# Altium project Sixth_Sense_PCB_Final.PrjPcb
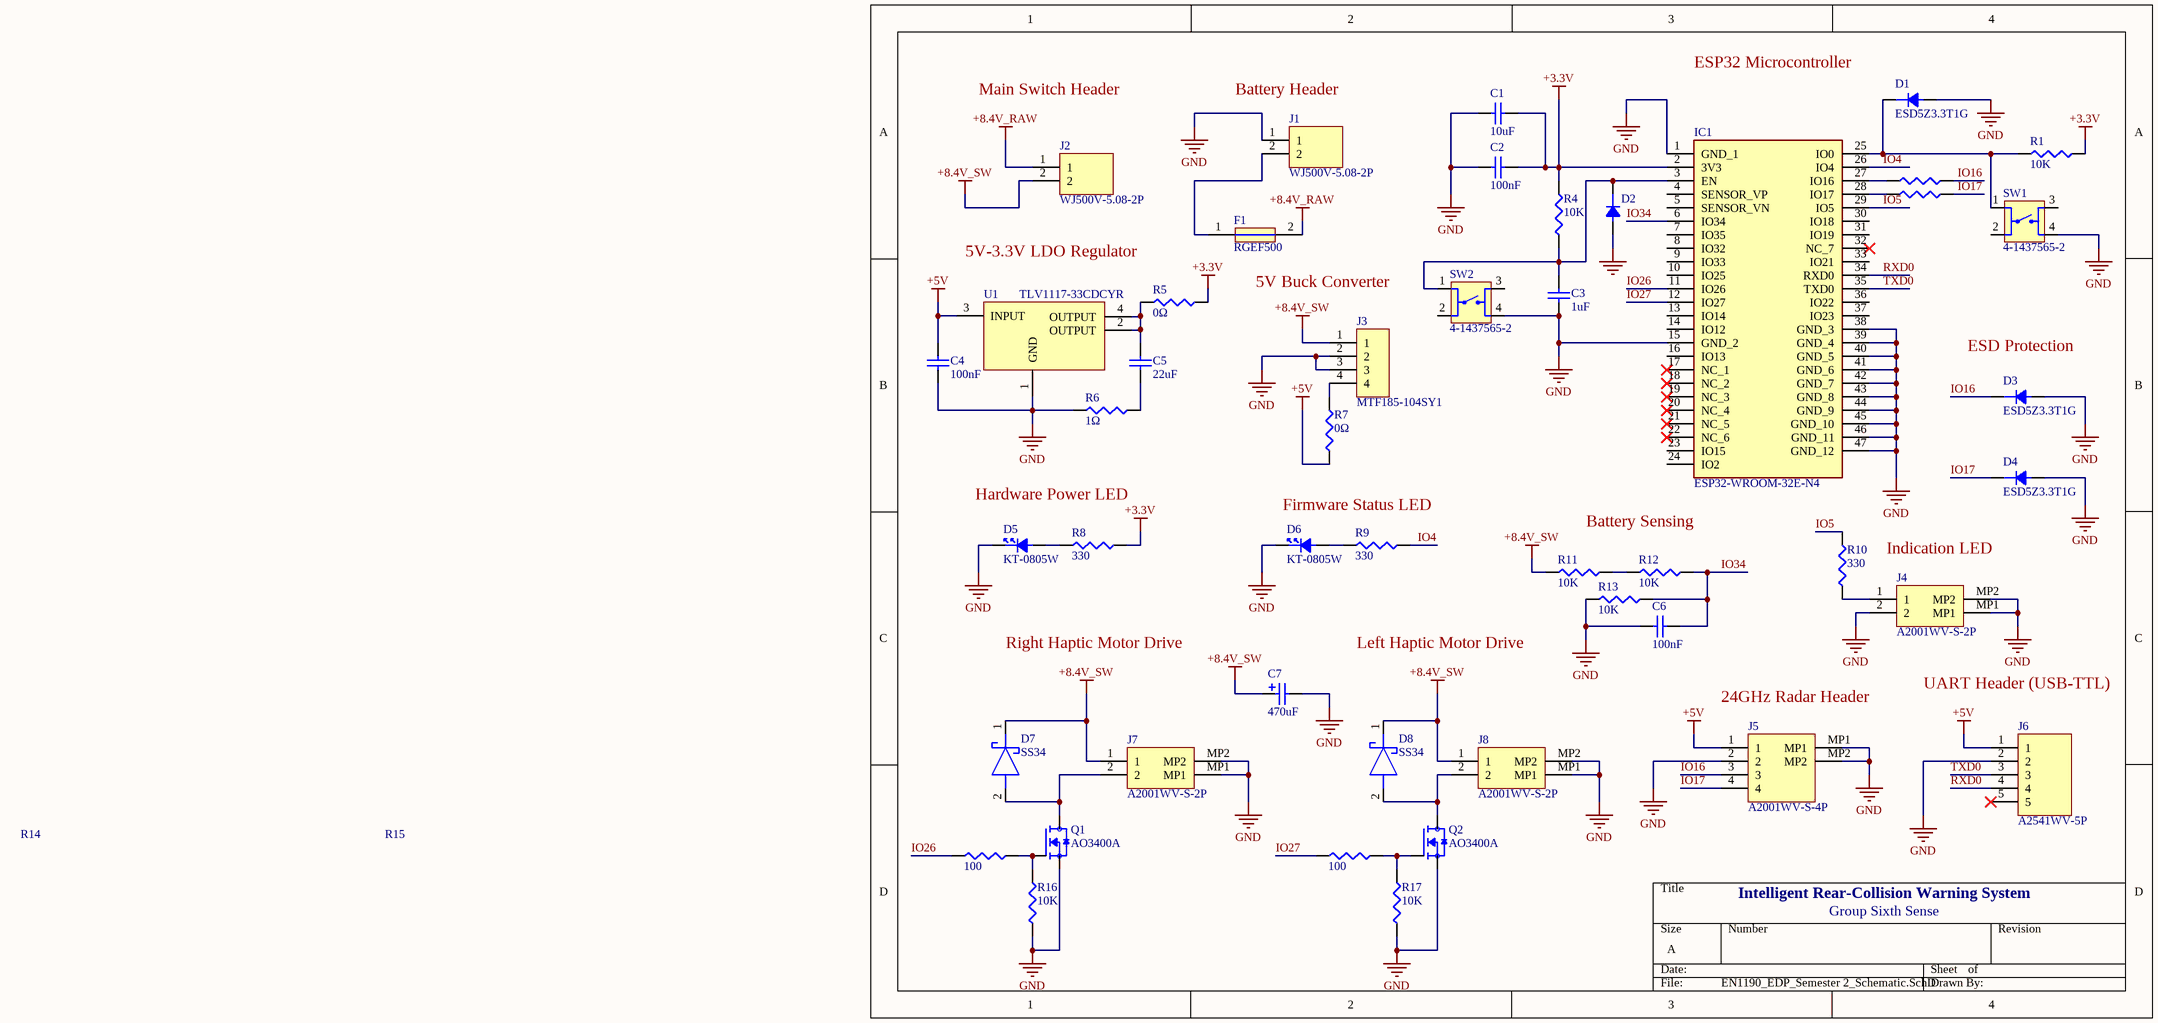
[diagram p0: EN1190_EDP_Semester 2_Schematic.SchDoc]
1 sheet, 47 parts. Net scope: global (net labels, ports and power ports of the same name join across sheets).
Board file: EN1190_EDP_Semester 2_PCB.PcbDoc

## Sheet EN1190_EDP_Semester 2_Schematic.SchDoc
size A; SheetNumber: 1; SheetTotal: 1

### Parts
C1  10uF  [CAPC2012X145N]
C2  100nF  [CAPC2012X70]
C3  1uF  [CAPC2012X135N]
C4  100nF  [CAPC2012X70]
C5  22uF  [CAPC3216X180N]
C6  100nF  [CAPC2012X70]
C7  470uF  [CAPPRD500W60D1025H1400]
D1  ESD5Z3.3T1G  [SODFL1608X70N]
D2  ESD5Z3.3T1G  [SODFL1608X70N]  (value not drawn)
D3  ESD5Z3.3T1G  [SODFL1608X70N]
D4  ESD5Z3.3T1G  [SODFL1608X70N]
D5  KT-0805W  [LED_KT-0805W]
D6  KT-0805W  [LED_KT-0805W]
D7  SS34  [DIOM5127X241N]
D8  SS34  [DIOM5127X241N]
F1  RGEF500  [RGEF500]
IC1  ESP32-WROOM-32E-N4  [ESP32WROOM32EN4]
J1  WJ500V-5.08-2P  [WJ500V5082P]
J2  WJ500V-5.08-2P  [WJ500V5082P]
J3  MTF185-104SY1  [RHDR4W64P0X254_1X4_1041X250X865P]
J4  A2001WV-S-2P  [A2001WVS2P]
J5  A2001WV-S-4P  [A2001WVS4P]
J6  A2541WV-5P  [HDRV5W64P0X254_1X5_1270X254X899P]
J7  A2001WV-S-2P  [A2001WVS2P]
J8  A2001WV-S-2P  [A2001WVS2P]
Q1  AO3400A  [SOT95P280X125-3N]
Q2  AO3400A  [SOT95P280X125-3N]
R1  10K  [RESC2012X65N]
R2  0Ω  [RESC2012X65N]  (value not drawn)
R3  0Ω  [RESC2012X65N]  (value not drawn)
R4  10K  [RESC2012X65N]
R5  0Ω  [RESC2012X65N]
R6  1Ω  [RESC2012X65N]
R7  0Ω  [RESC2012X65N]
R8  330  [RESC2012X65N]
R9  330  [RESC2012X65N]
R10  330  [RESC2012X65N]
R11  10K  [RESC2012X65N]
R12  10K  [RESC2012X65N]
R13  10K  [RESC2012X65N]
R14  100  [RESC2012X65N - duplicate]
R15  100  [RESC2012X65N - duplicate]
R16  10K  [RESC2012X65N]
R17  10K  [RESC2012X65N]
SW1  4-1437565-2  [SW_4-1437565-2]
SW2  4-1437565-2  [SW_4-1437565-2]
U1  TLV1117-33CDCYR  [SOT230P700X180-4N]

### Nets
+3.3V: C1.2 C2.1 IC1.2(3V3) R1.2 R4.1 R5.2 R8.2
+5V: C4.2 J5.1 J6.1 R7.1 U1.3(INPUT)
+8.4V_RAW: F1.2 J2.1
+8.4V_SW: C7.1 D7.1(K) D8.1(K) J2.2 J3.1 J7.1 J8.1 R11.2
GND: C1.1 C2.2 C3.1 C4.1 C6.1 C7.2 D1.2 D2.2 D3.2 D4.2 D5.1 D6.1 IC1.1(GND_1) IC1.15(GND_2) IC1.38(GND_3) IC1.39(GND_4) IC1.40(GND_5) IC1.41(GND_6) IC1.42(GND_7) IC1.43(GND_8) IC1.44(GND_9) IC1.45(GND_10) IC1.46(GND_11) IC1.47(GND_12) J1.1 J3.2 J3.3 J4.2 J4.MP1 J4.MP2 J5.2 J5.MP1 J5.MP2 J6.2 J7.MP1 J7.MP2 J8.MP1 J8.MP2 Q1.2(S) Q2.2(S) R6.2 R13.1 R16.2 R17.2 SW1.4 SW2.4 U1.1(GND)
IO4: IC1.26(IO4) R9.2
IO5: IC1.29(IO5) R10.2
IO16: D3.1 J5.3 R2.2
IO17: D4.1 J5.4 R3.2
IO26: IC1.11(IO26) R14.1
IO27: IC1.12(IO27) R15.1
IO34: C6.2 IC1.6(IO34) R12.1 R13.2
RXD0: IC1.34(RXD0) J6.4
TXD0: IC1.35(TXD0) J6.3
NetC3_2: C3.2 D2.1 IC1.3(EN) R4.2 SW2.1
NetC5_1: C5.1 R6.1
NetC5_2: C5.2 R5.1 U1.2(OUTPUT) U1.4(OUTPUT)
NetD1_1: D1.1 IC1.25(IO0) R1.1 SW1.1
NetD5_2: D5.2 R8.1
NetD6_2: D6.2 R9.1
NetD7_2: D7.2(A) J7.2 Q1.3(D)
NetD8_2: D8.2(A) J8.2 Q2.3(D)
NetF1_1: F1.1 J1.2
NetIC1_27: IC1.27(IO16) R2.1
NetIC1_28: IC1.28(IO17) R3.1
NetJ3_4: J3.4 R7.2
NetJ4_1: J4.1 R10.1
NetQ1_1: Q1.1(G) R14.2 R16.1
NetQ2_1: Q2.1(G) R15.2 R17.1
NetR11_1: R11.1 R12.2

Not connected (* = marked no-connect by the designer): IC1 4(SENSOR_VP) 5(SENSOR_VN) 7(IO35) 8(IO32) 9(IO33) 10(IO25) 13(IO14) 14(IO12) 16(IO13) 17(NC_1)* 18(NC_2)* 19(NC_3)* 20(NC_4)* 21(NC_5)* 22(NC_6)* 23(IO15) 24(IO2) 30(IO18) 31(IO19) 32(NC_7)* 33(IO21) 36(IO22) 37(IO23); J6 5*; SW1 2 3; SW2 2 3

### Notes on the sheet
- Main Switch Header
- (near J1) Battery Header
- (near D1) ESP32 Microcontroller
- 5V-3.3V LDO Regulator
- 5V Buck Converter
- (near D3) ESD Protection
- Hardware Power LED
- Firmware Status LED
- Battery Sensing
- Indication LED
- Right Haptic Motor Drive
- Left Haptic Motor Drive
- (near J5) 24GHz Radar Header
- UART Header (USB-TTL)
- Intelligent Rear-Collision Warning System
- Group Sixth Sense

### Library data of the parts
C1 = CL21A106KAYNNNE: 10uF ±10% 25V Ceramic Capacitor X5R 0805; Manufacturer: Samsung Electro-Mechanics; Value: 10uF; LCSC Part Number: C15850; JLCPCB Part Number: C15850; ComponentLink1Description: Datasheet; ComponentLink1URL: https://jlc-prod-smt.oss-eu-central-1.aliyuncs.com/smtDataManualFile/8579706853607202816-C15850.pdf?response-content-disposition=attachment%3B%20filename%3DC15850.pdf%3B%20filename%2A%3DUTF-8%27%27C15850.pdf&x-oss-date=20260411T105511Z&x-oss-expires=1800&x-oss-security-token=CAISgAN1q6Ft5B2yfSjIr5mHBczCp%2BpM0aimbG72lWcPTrsdp4f41zz2IHhMdHJsAOodtv0%2FmmhT6PkclqRLcbhpcmfjV%2BZHzLB8qakU4QF%2B4J7b16cNrbH4M4H6aXeirtuwDsz9SNTCALjPD3nPii50x5bjaDymRCbLGJaViJlhHLN1Ow6jdmhpCctxLAlvo9NgFxm3D%2Fu2NQPwiWf9FVdhvhEG6Vly8qOi2MaRmFy8yFTx0b0SvJ%2BjYMrmPctoN9JnSdC5mfdzau3a1TJ84gRD0a5wkaVA1zbDs5bfISEIuUzebreLqY03dV4mOvdqIcMe8qigz88fk%2FfIioH6xyxKOexoSCnFTOiiupCcQLPyao9jLu6iayqViY7QaIOTqQohZmkAMwVOasAsI3Ngh4zF97Qt0cVNkXO9gWfLI8DtuMleWsqp384DfnSgc5lCkRRYwGs1287ugXlSQzo890KPDAEovaKCnZ2ZSfh7Y4sNknI6i%2Bfc2Se2MIkISql4QaKWD5sagAEl%2FZh4y0mMFih4O2qONNFgo7OWr5xiyzqit1WFcmyLUIQ2NX%2Fko74FscrX5Z2PR81zrkE2%2BnLnFVK6SDKZ8Rrb9W3QelFNDx6QYlqH4AjNB9BxVOfYIzA8I8Ll0VvOEyDZ7hj5WXI%2BIfDeUmHR%2FNs6j%2FCz6XaWmqPEfMDbSSnTGiAA&x-oss-signature-version=OSS4-HMAC-SHA256&x-oss-credential=STS.NZ2NvvJ5mfjMnHGqgZB41HBS5%2F20260411%2Feu-central-1%2Foss%2Faliyun_v4_request&x-oss-signature=e4669f9a7ebed36f2888fbdcc03d20f0a9c6abf700cb8098047f1d5397c325ce; Manufacturer Part Number: CL21A106KAYNNNE
C2 C4 C6 = CC0805KRX7R9BB104: 100nF ±10% 50V Ceramic Capacitor X7R 0805; Manufacturer: YAGEO; Value: 100nF; Manufacturer Part Number: CC0805KRX7R9BB104; LCSC Part Number: C49678; JLCPCB Part Number: C49678; ComponentLink1Description: Datasheet; ComponentLink1URL: https://jlc-prod-smt.oss-eu-central-1.aliyuncs.com/smtDataManualFile/8579706882459549696-C49678.pdf?response-content-disposition=attachment%3B%20filename%3DC49678.pdf%3B%20filename%2A%3DUTF-8%27%27C49678.pdf&x-oss-date=20260411T120022Z&x-oss-expires=1800&x-oss-security-token=CAISgAN1q6Ft5B2yfSjIr5nGc%2B%2Fng%2BZTz6qoZ1LerE00VusYva%2FoiTz2IHhMdHJsAOodtv0%2FmmhT6PkclqRLcbhpcmfjV%2BZHzLB8qZxIqQR%2B4J7b16cNrbH4M4H6aXeirtuwDsz9SNTCALjPD3nPii50x5bjaDymRCbLGJaViJlhHLN1Ow6jdmhpCctxLAlvo9NgFxm3D%2Fu2NQPwiWf9FVdhvhEG6Vly8qOi2MaRmFy8yFTx0b0SvJ%2BjYMrmPctoN9JnSdC5mfdzau3a1TJ84gRD0a5wkaVA1zbDs5bfISEIuUzebreLqY03dV4mOvdqIcMe8qigz88fk%2FfIioH6xyxKOexoSCnFTOiiupCcQLPyao9jLu6iayqViY7QaIOTqQohZmkAMwVOasAsI3Ngh4zF97Qt0cVNkXO9gWfLI8DtuMleWgpjW%2BgjfnSgc5lCkRRYwGs1287ugXlSQzo890KPDAEovaKCnZ2ZSfh7Y4sNknI6i%2Bfc2Se2MIkIet4joqKWD5sagAGoaAFtiNH%2BVqesP4Xd%2FicMChU4hC%2BfFSKA8gk%2FP%2BHFmqX9GC9FZogyDW2xwxXMN%2BJ5kWUM5GYkddsvBUaVRQY2O5hriYbqbheGKrzCEsRoZQpM1BVK9kdwDFJRIKfktOAz8byi%2FH7to7wLWy8UkpOhwQ%2B%2BZ%2FjjINlLWCMSxpgZsCAA&x-oss-signature-version=OSS4-HMAC-SHA256&x-oss-credential=STS.NZs8USn9rxhCetoHMaZd4RjCk%2F20260411%2Feu-central-1%2Foss%2Faliyun_v4_request&x-oss-signature=707c7aad44b40ae88f8940f66cbb3d06b4fd0582da1b3e21eb645b0540d9b004
C3 = CL21B105KBFNNNE: 1uF ±10% 50V Ceramic Capacitor X7R 0805; Manufacturer: Samsung Electro-Mechanics; LCSC Part Number: C28323; Value: 1uF; Manufactuer Part Number: CL21B105KBFNNNE; JLCPCB Part Number: C28323; ComponentLink1Description: Datasheet; ComponentLink1URL: https://jlcpcb.com/api/file/downloadByFileSystemAccessId/8579706862004473856
C5 = CL31A226KOHNNNE: 22uF ±10% 16V Ceramic Capacitor X5R 1206; LCSC Part Number: C90146; Value: 22uF; Voltage Rating: 16V; Dielectric: X5R; Package: 1206; ComponentLink1Description: Datasheet; ComponentLink1URL: https://www.lcsc.com/datasheet/C90146.pdf?spm=wm.sxq.inf.ggs___wm.ssy.bg.0.xh&lcsc_vid=RABaBF1SE1RfBlVeElBYVQJWQVdaBVJRQ1JYAwFXQFYxVlNRQlFcXlNeTlVbUjsOAxUeFF5JWBYZEEoKFBINSQcJGk4dAgUUFAk%3D
C7 = 25YXJ470M10X12.5: 470uF 25V Aluminum Electrolytic Capacitors Through Hole,D10xL12.5mm 10000hrs@105℃; Manufacturer: Rubycon; Value: 470 uF; LCSC Part Number: C88740; JLCPCB Part Number: C88740; Manufacturer Part Number: 25YXJ470M10X12.5; ComponentLink1Description: Datasheet; ComponentLink1URL: https://jlc-prod-smt.oss-eu-central-1.aliyuncs.com/smtDataManualFile/8588887453180563456-C88740.pdf?response-content-disposition=attachment%3B%20filename%3DC88740.pdf%3B%20filename%2A%3DUTF-8%27%27C88740.pdf&x-oss-date=20260411T113131Z&x-oss-expires=1800&x-oss-security-token=CAISgAN1q6Ft5B2yfSjIr5mHBczCp%2BpM0aimbG72lWcPTrsdp4f41zz2IHhMdHJsAOodtv0%2FmmhT6PkclqRLcbhpcmfjV%2BZHzLB8qakU4QF%2B4J7b16cNrbH4M4H6aXeirtuwDsz9SNTCALjPD3nPii50x5bjaDymRCbLGJaViJlhHLN1Ow6jdmhpCctxLAlvo9NgFxm3D%2Fu2NQPwiWf9FVdhvhEG6Vly8qOi2MaRmFy8yFTx0b0SvJ%2BjYMrmPctoN9JnSdC5mfdzau3a1TJ84gRD0a5wkaVA1zbDs5bfISEIuUzebreLqY03dV4mOvdqIcMe8qigz88fk%2FfIioH6xyxKOexoSCnFTOiiupCcQLPyao9jLu6iayqViY7QaIOTqQohZmkAMwVOasAsI3Ngh4zF97Qt0cVNkXO9gWfLI8DtuMleWsqp384DfnSgc5lCkRRYwGs1287ugXlSQzo890KPDAEovaKCnZ2ZSfh7Y4sNknI6i%2Bfc2Se2MIkISql4QaKWD5sagAEl%2FZh4y0mMFih4O2qONNFgo7OWr5xiyzqit1WFcmyLUIQ2NX%2Fko74FscrX5Z2PR81zrkE2%2BnLnFVK6SDKZ8Rrb9W3QelFNDx6QYlqH4AjNB9BxVOfYIzA8I8Ll0VvOEyDZ7hj5WXI%2BIfDeUmHR%2FNs6j%2FCz6XaWmqPEfMDbSSnTGiAA&x-oss-signature-version=OSS4-HMAC-SHA256&x-oss-credential=STS.NZ2NvvJ5mfjMnHGqgZB41HBS5%2F20260411%2Feu-central-1%2Foss%2Faliyun_v4_request&x-oss-signature=1a71cdcfdccf2f12d85f81b9bbe3019779a73c3eac2156f4ea9bb6aa6537d4d7
D1-D4 = ESD5Z3.3T1G: 14.1VC Clamp 11.2A Ipp TVS DIODE SOD-523; Manufacturer: onsemi; Package: SOD-523; Manufactuer Part Number: ESD5Z3.3T1G; LCSC Part Number: C61148; JLCPCB Part Number: C61148
D5 D6 = KT-0805W: White LED Indication - Discrete 2.6V~3.2V 0805; Manufacturer: Hubei KENTO Elec; Package: 0805; Manufacturer Part Number: KT-0805W; LCSC Part Number: C34499; JLCPCB Part Number: C34499; ComponentLink1Description: Datasheet; ComponentLink1URL: https://jlc-prod-smt.oss-eu-central-1.aliyuncs.com/smtDataManualFile/8579709217554550784-C34499.pdf?response-content-disposition=attachment%3B%20filename%3DC34499.pdf%3B%20filename%2A%3DUTF-8%27%27C34499.pdf&x-oss-date=20260411T184242Z&x-oss-expires=1800&x-oss-security-token=CAISgAN1q6Ft5B2yfSjIr5rxL87d1ahJ54SaRGiFlmVtZtlOi%2FzfgDz2IHhMdHJsAOodtv0%2FmmhT6PkclqRLcbhpcmfjV%2BZHzLB8qedY9A1%2B4J7b16cNrbH4M4H6aXeirtuwDsz9SNTCALjPD3nPii50x5bjaDymRCbLGJaViJlhHLN1Ow6jdmhpCctxLAlvo9NgFxm3D%2Fu2NQPwiWf9FVdhvhEG6Vly8qOi2MaRmFy8yFTx0b0SvJ%2BjYMrmPctoN9JnSdC5mfdzau3a1TJ84gRD0a5wkaVA1zbDs5bfISEIuUzebreLqY03dV4mOvdqIcMe8qigz88fk%2FfIioH6xyxKOexoSCnFTOiiupCcQLPyao9jLu6iayqViY7QaIOTqQohZmkAMwVOasAsI3Ngh4zF97Qt0cVNkXO9gWfLI8DtuMleWhqk2cFN4NHD0eS19jklBdzSlusJRAJJUVBflCeKEaRNSAd3WGhEfM2%2BBt4QT30w5N2u00S8OSMI6E2D5aKWD5sagAFK8BQxMu8mWm493Yp8afuko%2BzCNYQ%2Fa05kesz6Q%2FupjBJH0QROBTrIeTMPgE8%2BlaT39xZqteU6mYIp0xOFqOLJoWNfG8KcrwmMtaWL3ntf0XKyARj9oJ%2FZoCX14gg3wra056deeiiUhn7e1b6JV2uHe3%2BhOvW6pNMsqkWNyqxHxSAA&x-oss-signature-version=OSS4-HMAC-SHA256&x-oss-credential=STS.NYDdti8whPFqFN4re8jVbd9tb%2F20260411%2Feu-central-1%2Foss%2Faliyun_v4_request&x-oss-signature=fb576c8a806889d858e314a909d44b6f08958b502a4255edb32084c04d6872af
D7 D8 = SS34 SMA: Diode Independent 40V 3A Surface Mount SMA(DO-214AC); Manufacturer: MDD(Microdiode Semiconductor); LCSC Part Number: C8678; Manufacturer Part Number: SS34; ComponentLink1Description: Datasheet; ComponentLink1URL: https://www.lcsc.com/datasheet/C8678.pdf?spm=wm.sxq.inf.ggs___wm.ssy.bg.2.xh&lcsc_vid=RABaBF1SE1RfBlVeElBYVQJWQVdaBVJRQ1JYAwFXQFYxVlNRQlBfVVNfT1hcXzsOAxUeFF5JWBYZEEoKFBINSQcJGk4dAgUUFAk%3D; JLCPCB Part Number: C8678
F1 = RGEF500: Polymeric PTC Resettable Fuse 16V 5A Through Hole P=5.08mm; Manufacturer: Littelfuse; Manufacturer Part Number: RGEF500; LCSC Part Number: C468988; JLCPCB Part Number: C468988
IC1 = ESP32-WROOM-32E-N4: 2.4GHz On-board PCB Antenna -98dBm SMD,25.5x18mm RF Transceiver Modules and Modems RoHS; Manufacturer_Name: Espressif Systems; Datasheet Link: https://www.espressif.com/sites/default/files/documentation/esp32-wroom-32e_esp32-wroom-32ue_datasheet_en.pdf; Height: 3.25mm; Manufacturer_Part_Number: ESP32-WROOM-32E-N4; Mouser Part Number: 356-ESP32WRM32E132PH; Mouser Price/Stock: https://www.mouser.co.uk/ProductDetail/Espressif-Systems/ESP32-WROOM-32E-N4?qs=Li%252BoUPsLEnsPzTWsi%252BRMgQ%3D%3D; LCSC Part Number: C701341; ComponentLink1Description: Datasheet; ComponentLink1URL: https://jlcpcb.com/api/file/downloadByFileSystemAccessId/8588886930931535873
J1 J2 = WJ500V-5.08-2P: 2 Position Wire to Board Terminal Block Through Hole 5.08mm; Manufacturer_Name: Ningbo Kangnex; Datasheet Link: https://datasheet.lcsc.com/szlcsc/1912251636_Ningbo-Kangnex-Elec-WJ500V-5-08-2P_C8465.pdf; Height: 14.2mm; Manufacturer_Part_Number: WJ500V-5.08-2P; LCSC Part Number: C8465; JLCPCB Part Number: C8465; ComponentLink1Description: Datasheet; ComponentLink1URL: https://www.lcsc.com/datasheet/C8465.pdf?spm=wm.sxq.inf.ggs___wm.ssy.bg.0.xh&lcsc_vid=RABaBF1SE1RfBlVeElBYVQJWQVdaBVJRQ1JYAwFXQFYxVlNRQlBcUlZfQFdbVDsOAxUeFF5JWBYZEEoKFBINSQcJGk4eFQsCAgIaSgADAwAHC0slRVNbVVZeWQkaCgg%3D
J3 = MTF185-104SY1: Female Header 4 Position 2.54mm Pitch Single Row Through Hole; Manufacturer: Mintron; LCSC Part Number: C358718; Pitch: 2.54mm; ComponentLink1Description: Datasheet; ComponentLink1URL: *https://www.lcsc.com/datasheet/C358718.pdf?spm=wm.sxq.inf.ggs___wm.ssy.bg.0.xh&lcsc_vid=RABaBF1SE1RfBlVeElBYVQJWQVdaBVJRQ1JYAwFXQFYxVlNRQlFdX1FeQFhaUzsOAxUeFF5JWBYZEEoKFBINSQcJGk4%3D
J4 J7 J8 = A2001WV-S-2P: Connector Header 2 position 2mm Pitch; Manufacturer_Name: Changjiang Connectors; Datasheet Link: https://datasheet.lcsc.com/szlcsc/Changjiang-Connectors-A2001WV-S-2P_C225226.pdf; Height: 6.42mm; Manufacturer_Part_Number: A2001WV-S-2P; LCSC Part Number: C225226; JLCPCB Part Number: C225226; ComponentLink1Description: Datasheet; ComponentLink1URL: https://www.lcsc.com/datasheet/C225226.pdf?spm=wm.sxq.inf.ggs___wm.ssy.bg.0.xh&lcsc_vid=RABaBF1SE1RfBlVeElBYVQJWQVdaBVJRQ1JYAwFXQFYxVlNRQlBcVVBUQldZXzsOAxUeFF5JWBYZEEoKFBINSQcJGk4dAgUUFAk%3D
J5 = A2001WV-S-4P: Connector Header 4 position 2mm Pitch; Manufacturer_Name: CJT; Datasheet Link: https://datasheet.lcsc.com/szlcsc/1912111437_CNJM-A2001WV-S-4P_C375145.pdf; Height: 6.55mm; Manufacturer_Part_Number: A2001WV-S-4P; LCSC Part Number: C225228; JLCPCB Part Number: C225228; ComponentLink1Description: Datasheet; ComponentLink1URL: https://www.lcsc.com/datasheet/C225228.pdf?spm=wm.sxq.inf.ggs___wm.ssy.bg.1.xh&lcsc_vid=RABaBF1SE1RfBlVeElBYVQJWQVdaBVJRQ1JYAwFXQFYxVlNRQlBcVFFXT1hWVDsOAxUeFF5JWBYZEEoKFBINSQcJGk4dAgUUFAk%3D
J6 = A2541WV-5P: Pin Header 5 Position 2.54mm Pitch Single Row Through Hole -40℃~+105℃; Manufacturer_Name: Changjiang Connectors; Datasheet Link: https://datasheet.lcsc.com/lcsc/2010160505_CJT-Changjiang-Connectors-A2541WV-5P_C225480.pdf; Height: 8.99mm; Manufacturer_Part_Number: A2541WV-5P; LCSC Part Number: C225480; JLCPCB Part Number: C225480; ComponentLink1Description: Datasheet; ComponentLink1URL: https://jlcpcb.com/api/file/downloadByFileSystemAccessId/8588890082421428224
Q1 Q2 = AO3400A: N-Channel 30 V 5.7A (Ta) 1.4W (Ta) Surface Mount SOT-23-3; Manufacturer: AOS; MF: Alpha & Omega Semiconductor; SnapEDA_Link: https://www.snapeda.com/parts/AO3400A/Alpha/view-part/?ref=snap; Package: SOT-23 Alpha &amp; Omega Semiconductor Inc.; Value: *; MP: AO3400A; Check_prices: https://www.snapeda.com/parts/AO3400A/Alpha/view-part/?ref=eda; LCSC Part Number: C20917; Manufacturer Part Number: AO3400A; JLCPCB Part Number: C20917; ComponentLink1Description: Datasheet; ComponentLink1URL: https://jlcpcb.com/api/file/downloadByFileSystemAccessId/8550723985357750272
R1 R4 R11-R13 R16 R17 = 0805W8F1002T5E: 10kΩ ±1% 125mW 0805 Thick Film Resistor; Manufactuer: UNI-ROYAL; LCSC Part Number: C17414; Value: 10K; Manufactuer Part Number: 0805W8F1002T5E; ComponentLink1Description: Datasheet; ComponentLink1URL: https://www.lcsc.com/datasheet/C17414.pdf?spm=wm.sxq.inf.ggs___wm.ssy.bg.0.xh&lcsc_vid=RABaBF1SE1RfBlVeElBYVQJWQVdaBVJRQ1JYAwFXQFYxVlNRQlFbUFdWRVVaXjsOAxUeFF5JWBYZEEoKFBINSQcJGk4dAgUUFAk%3D; JLCPCB Part Number: C17414
R2 R3 R5 R7 = 0805W8F0000T5E: 0Ω ±1% 125mW 0805 Thick Film Resistor; Manufacturer: UNI-ROYAL; Value: 0Ω; Manufacturer Part Number: 0805W8F0000T5E; LCSC Part Number: C17477; JLCPCB Part Number: C17477; Package: 0805; ComponentLink1Description: Datasheet; ComponentLink1URL: https://jlc-prod-smt.oss-eu-central-1.aliyuncs.com/smtDataManualFile/8579706711109648384-C17477.pdf?response-content-disposition=attachment%3B%20filename%3DC17477.pdf%3B%20filename%2A%3DUTF-8%27%27C17477.pdf&x-oss-date=20260412T143321Z&x-oss-expires=1800&x-oss-security-token=CAISgAN1q6Ft5B2yfSjIr5nyO4nX2q9R5biEUnLE00gMPuhu3abSozz2IHhMdHJsAOodtv0%2FmmhT6PkclqRLcbhpcmfjV%2BZHzLB8qZpNjnBx4J7b16cNrbH4M4H6aXeirtuwDsz9SNTCALjPD3nPii50x5bjaDymRCbLGJaViJlhHLN1Ow6jdmhpCctxLAlvo9NgFxm3D%2Fu2NQPwiWf9FVdhvhEG6Vly8qOi2MaRmFy8yFTx0b0SvJ%2BjYMrmPctoN9JnSdC5mfdzau3a1TJ84gRD0a5wkaVA1zbDs5bfISEIuUzebreLqY03dV4mOvdqIcMe8qigz88fk%2FfIioH6xyxKOexoSCnFTOiiupCcQLPyao9jLu6iayqViY7QaIOTqQohZmkAMwVOasAsI3Ngh4zF97Qt0cVNkXO9gWfLI8DtuMleWgplTVFfmNHD0eS19jklBdzSlusJRAJJUVBflCeKEaRNSAd3WGhEfM2%2BBt4QT30w5N2u00S8OSMIWkFI%2FqKWD5sagAFMYmSDkmn%2F%2BcekIzcMzzdbVSwM0STcarjaoT26L9OtNgZTnB7H1R7N0I2dIqfiFkQhlHKlIxpCo4TPXjjrrO0nPu3nlPM6%2BybxLo79aULExC%2F2ecJLuyv9wwf9%2BDNc5qnlP8hW5eyApEr09dDbELjMi4nFhTVDGkVC96xISiqCoyAA&x-oss-signature-version=OSS4-HMAC-SHA256&x-oss-credential=STS.NZGp3c7ppRzoPTu7HY2gB2cyA%2F20260412%2Feu-central-1%2Foss%2Faliyun_v4_request&x-oss-signature=21e3d6807f7d7309755c64a3f8fcdaf05ac216ad67c57dfe14021958a16245de
R6 = 0805W8F100KT5E: 1Ω ±1% 125mW 0805 Thick Film Resistor; Manufacturer: UNI-ROYAL; Value: 1Ω; Manufacturer Part Number: 0805W8F100KT5E; LCSC Part Number: C25271; JLCPCB Part Number: C25271; ComponentLink1Description: Datasheet; ComponentLink1URL: https://jlc-prod-smt.oss-eu-central-1.aliyuncs.com/smtDataManualFile/8579706684220100608-C25271.pdf?response-content-disposition=attachment%3B%20filename%3DC25271.pdf%3B%20filename%2A%3DUTF-8%27%27C25271.pdf&x-oss-date=20260411T192414Z&x-oss-expires=1800&x-oss-security-token=CAISgAN1q6Ft5B2yfSjIr5nwHf%2FBv5pz1ITfV1WGoHIEVcximK%2FSjTz2IHhMdHJsAOodtv0%2FmmhT6PkclqRLcbhpcmfjV%2BZHzLB8qeV9vRB%2B4J7b16cNrbH4M4H6aXeirtuwDsz9SNTCALjPD3nPii50x5bjaDymRCbLGJaViJlhHLN1Ow6jdmhpCctxLAlvo9NgFxm3D%2Fu2NQPwiWf9FVdhvhEG6Vly8qOi2MaRmFy8yFTx0b0SvJ%2BjYMrmPctoN9JnSdC5mfdzau3a1TJ84gRD0a5wkaVA1zbDs5bfISEIuUzebreLqY03dV4mOvdqIcMe8qigz88fk%2FfIioH6xyxKOexoSCnFTOiiupCcQLPyao9jLu6iayqViY7QaIOTqQohZmkAMwVOasAsI3Ngh4zF97Qt0cVNkXO9gWfLI8DtuMleWhrmUtJd4NHD0eS19jklBdzSlusJRAJJUVBflCeKEaRNSAd3WGhEfM2%2BBt4QT30w5N2u00S8OSMIXEoBg6KWD5sagAFM2bJhCWU10nwbpzu1GUCoVx5uuHCslNDM%2BlhQX6abpaI6ldYS%2F4qlTVCAsql0Hp%2BGi4MItIdcoGzjZjIIPLEJckf74CE6w7fsRPbBuw%2B0Xt0RphJySBq5WGFELtl%2FdJPtlxPln7sGlPKm%2F%2FedgNbbmSiw93ArFBzKJ2n9Ljzw3yAA&x-oss-signature-version=OSS4-HMAC-SHA256&x-oss-credential=STS.NZEVEuRERcF4Us7DrQYCNwjyo%2F20260411%2Feu-central-1%2Foss%2Faliyun_v4_request&x-oss-signature=38608f5da24cceb194364b95fe4b87cb62cdb2ea906a54d36b0422916f867635
R8-R10 = 0805W8F3300T5E: 330Ω ±1% 125mW 0805 Thick Film Resistor; Manufacturer: UNI-ROYAL; Value: 330 Ohms; Manufacturer Part Number: 0805W8F3300T5E; LCSC Part Number: C17630; JLCPCB Part Number: C17630; Package: 0805; ComponentLink1Description: Datasheet; ComponentLink1URL: https://jlc-prod-smt.oss-eu-central-1.aliyuncs.com/smtDataManualFile/8579706569885270016-C17630.pdf?response-content-disposition=attachment%3B%20filename%3DC17630.pdf%3B%20filename%2A%3DUTF-8%27%27C17630.pdf&x-oss-date=20260411T175041Z&x-oss-expires=1800&x-oss-security-token=CAISgAN1q6Ft5B2yfSjIr5rxL87d1ahJ54SaRGiFlmVtZtlOi%2FzfgDz2IHhMdHJsAOodtv0%2FmmhT6PkclqRLcbhpcmfjV%2BZHzLB8qedY9A1%2B4J7b16cNrbH4M4H6aXeirtuwDsz9SNTCALjPD3nPii50x5bjaDymRCbLGJaViJlhHLN1Ow6jdmhpCctxLAlvo9NgFxm3D%2Fu2NQPwiWf9FVdhvhEG6Vly8qOi2MaRmFy8yFTx0b0SvJ%2BjYMrmPctoN9JnSdC5mfdzau3a1TJ84gRD0a5wkaVA1zbDs5bfISEIuUzebreLqY03dV4mOvdqIcMe8qigz88fk%2FfIioH6xyxKOexoSCnFTOiiupCcQLPyao9jLu6iayqViY7QaIOTqQohZmkAMwVOasAsI3Ngh4zF97Qt0cVNkXO9gWfLI8DtuMleWhqk2cFN4NHD0eS19jklBdzSlusJRAJJUVBflCeKEaRNSAd3WGhEfM2%2BBt4QT30w5N2u00S8OSMI6E2D5aKWD5sagAFK8BQxMu8mWm493Yp8afuko%2BzCNYQ%2Fa05kesz6Q%2FupjBJH0QROBTrIeTMPgE8%2BlaT39xZqteU6mYIp0xOFqOLJoWNfG8KcrwmMtaWL3ntf0XKyARj9oJ%2FZoCX14gg3wra056deeiiUhn7e1b6JV2uHe3%2BhOvW6pNMsqkWNyqxHxSAA&x-oss-signature-version=OSS4-HMAC-SHA256&x-oss-credential=STS.NYDdti8whPFqFN4re8jVbd9tb%2F20260411%2Feu-central-1%2Foss%2Faliyun_v4_request&x-oss-signature=036771816ae3764e31e07c85ed9730db8d6cf2b2603abf8dd139ac35ac504947
R14 R15 = 0805W8F1000T5E: 100Ω ±1% 125mW 0805 Thick Film Resistor; Manufacturer: UNI-ROYAL; Value: 100 ohm; LCSC Part Number: C17408; Manufacturer Part Number: 0805W8F1000T5E; JLCPCB Part Number: C17408
SW1 SW2 = 4-1437565-2: Switch Tactile OFF (ON) SPST Round Button Gull Wing 0.05A 24VDC 1VA 9.18N SMD T/R; MF: TE Connectivity; MP: FSM4JSMATR; SnapEDA_Link: https://www.snapeda.com/parts/FSM4JSMATR/TE+Connectivity+ALCOSWITCH+Switches/view-part/?ref=snap; Package: None; Value: *; Check_prices: https://www.snapeda.com/parts/FSM4JSMATR/TE+Connectivity+ALCOSWITCH+Switches/view-part/?ref=eda; LCSC Part Number: C2680629; Manufacturer Part Number: FSM4JSMATR; Manufacturer: TE Connectivity; JLCPCB Part Number: C2680629; ComponentLink1Description: Datasheet; ComponentLink1URL: https://jlcpcb.com/api/file/downloadByFileSystemAccessId/8589835793184423936
U1 = TLV1117-33CDCYR: 3.3V 15V Positive Fixed SOT-223 Voltage Regulators - Linear, Low Drop Out (LDO) Regulators RoHS; LCSC Part Number: C91728; ComponentLink1Description: Datasheet; ComponentLink1URL: https://www.lcsc.com/datasheet/C91728.pdf?spm=wm.sxq.inf.ggs___wm.ssy.bg.0.xh&lcsc_vid=RABaBF1SE1RfBlVeElBYVQJWQVdaBVJRQ1JYAwFXQFYxVlNRQlFcUVRRRVhaUjsOAxUeFF5JWBYZEEoKFBINSQcJGk4dAgUUFAk%3D